# Altium schematic sheet MainBoard_V1p0_PER.SchDoc
size A4; SheetNumber: 5; SheetTotal: 8
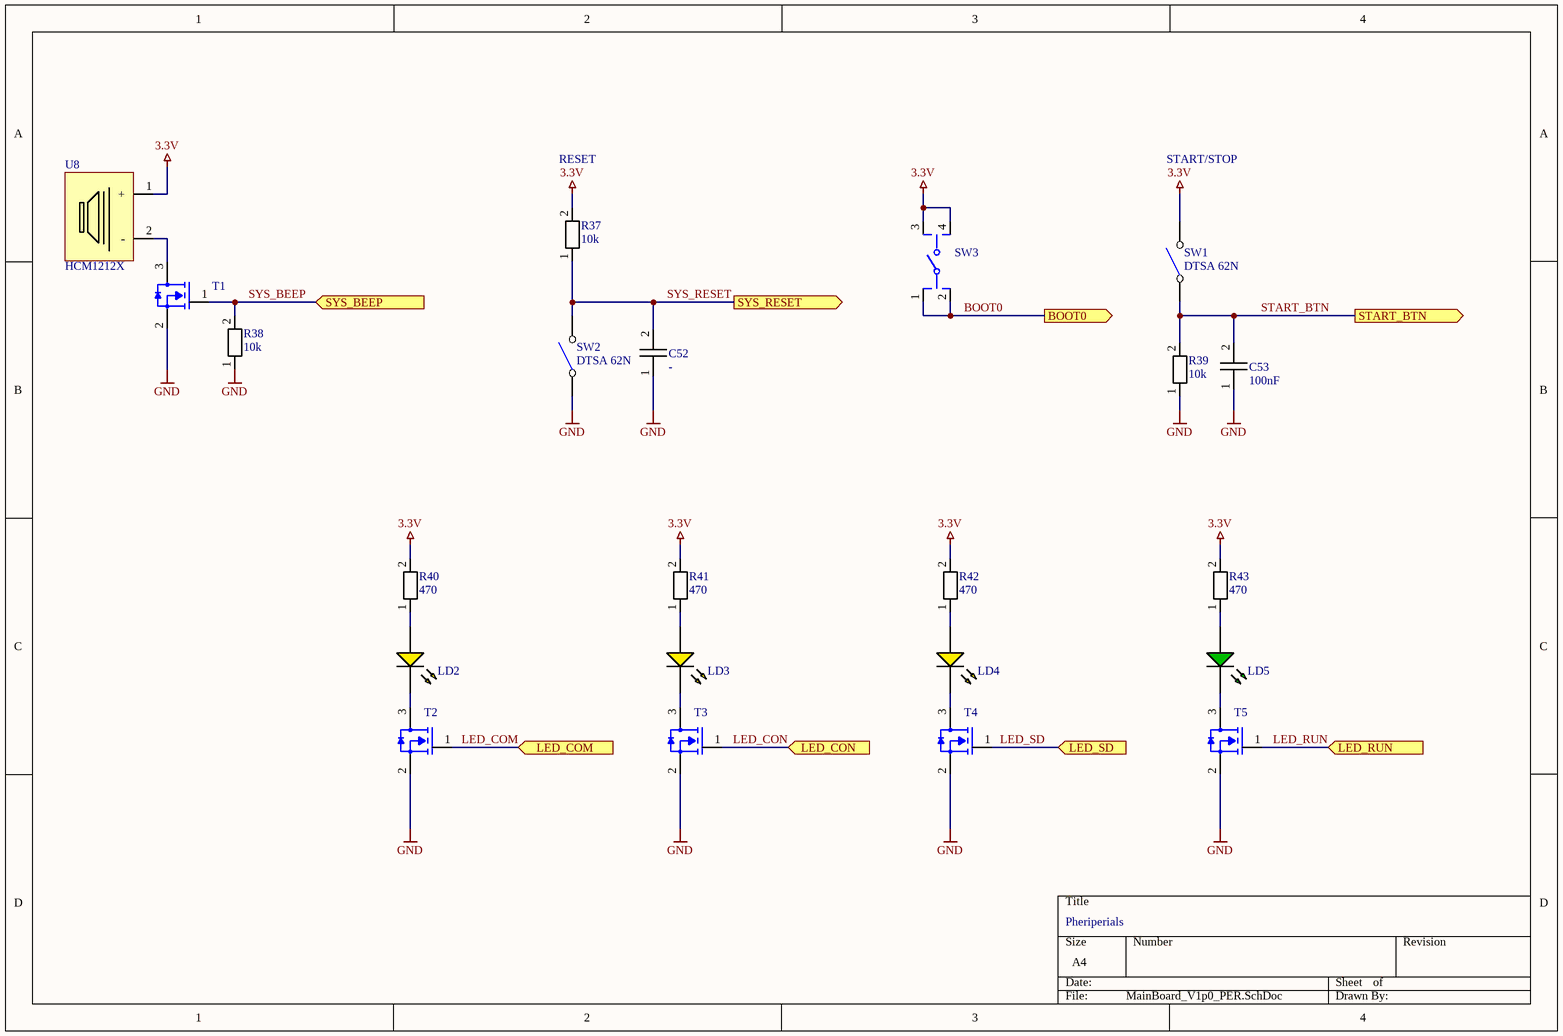
[diagram p0: MainBoard_V1p0_PER.SchDoc]

## Parts
C52  -  [0805_C]
C53  100nF  [0805_C]
LD2  LED_YEL  [LED_SMD_90DEG_YEL]  (value not drawn)
LD3  LED_YEL  [LED_SMD_90DEG_YEL]  (value not drawn)
LD4  LED_YEL  [LED_SMD_90DEG_YEL]  (value not drawn)
LD5  LED_GREEN  [LED_SMD_90DEG_GRE]  (value not drawn)
R37  10k  [0805]
R38  10k  [0805]
R39  10k  [0805]
R40  470  [0805]
R41  470  [0805]
R42  470  [0805]
R43  470  [0805]
SW1  DTSA 62N  [SW_DTSA-62N]
SW2  DTSA 62N  [SW_DTSA-62N]
SW3  Switch_C&K_KSC241JLFS_eec  [C&K_KSC241JLFS]  (value not drawn)
T1  MMBF170  [SOT23]  (value not drawn)
T2  MMBF170  [SOT23]  (value not drawn)
T3  MMBF170  [SOT23]  (value not drawn)
T4  MMBF170  [SOT23]  (value not drawn)
T5  MMBF170  [SOT23]  (value not drawn)
U8  HCM1212X  [HCM1212X]

## Ports
BOOT0 (out), LED_COM (in), LED_CON (in), LED_RUN (in), LED_SD (in), START_BTN (out), SYS_BEEP (in), SYS_RESET (out)

## Nets
3.3V: R37.2 R40.2 R41.2 R42.2 R43.2 SW1.2 SW3.3 SW3.4 U8.1(+)
GND: C52.1 C53.1 R38.1 R39.1 SW2.1 T1.2(Source) T2.2(Source) T3.2(Source) T4.2(Source) T5.2(Source)
BOOT0: SW3.1 SW3.2 ; port BOOT0
LED_COM: T2.1(Gate) ; port LED_COM
LED_CON: T3.1(Gate) ; port LED_CON
LED_RUN: T5.1(Gate) ; port LED_RUN
LED_SD: T4.1(Gate) ; port LED_SD
START_BTN: C53.2 R39.2 SW1.1 ; port START_BTN
SYS_BEEP: R38.2 T1.1(Gate) ; port SYS_BEEP
SYS_RESET: C52.2 R37.1 SW2.2 ; port SYS_RESET
NetLD2_A: LD2.A R40.1
NetLD2_K: LD2.K T2.3(Drain)
NetLD3_A: LD3.A R41.1
NetLD3_K: LD3.K T3.3(Drain)
NetLD4_A: LD4.A R42.1
NetLD4_K: LD4.K T4.3(Drain)
NetLD5_A: LD5.A R43.1
NetLD5_K: LD5.K T5.3(Drain)
NetT1_3: T1.3(Drain) U8.2(-)

## Notes on the sheet
- RESET
- START/STOP
- Pheriperials

## Library data of the parts
C52 C53 = CAPACITOR
LD2-LD4 = LED_YEL: Type (0°): LTSTC170YKT; Type (90°): HSMY-C110
LD5 = LED_GREEN: Type (0°): LTST-C170KGKT; Type (90°): HSMG-C110
R37-R39 = RESISTOR: Parameter 1: 10k
R40-R43 = RESISTOR: Parameter 1: 10k
SW1 SW2 = SW_DTSA 62N
SW3 = Switch_C&K_KSC241JLFS_eec: SWITCH TACTILE SPST-NO 0.05A 32V; Manufacturer: C&K; Part Number: KSC241JLFS; helpURL: https://upverter.com/upn/revision/9eb490e79e988993/; ComponentLink2Description: Datasheet; Temperature: -40°C to +85°C; Package: SMT_SW_6MM2_6MM2; Supplier 2: Mouser; Supplier 1: Digi-Key; ComponentLink1URL: https://upverter.com/upn/revision/9eb490e79e988993/; Supplier Part Number 2: 611-KSC241J-LFS; Supplier Part Number 1: 401-1762-1-ND; ComponentLink1Description: Upverter; ComponentLink2URL: http://www.ckswitches.com/media/1459/ksc.pdf; RoHS: TRUE; Mouser Part Number: 611-KSC241J-LFS; Digikey Description: SWITCH TACTILE SPST-NO 0.05A 32V; Digikey Part Number: 401-1762-1-ND; Lead Free: yes; Temperature Range Low: -40°C; Temperature Range High: +85°C
T1-T5 = MMBF170: N MOSFET